# Altium schematic sheet Antenna.SchDoc
size A4
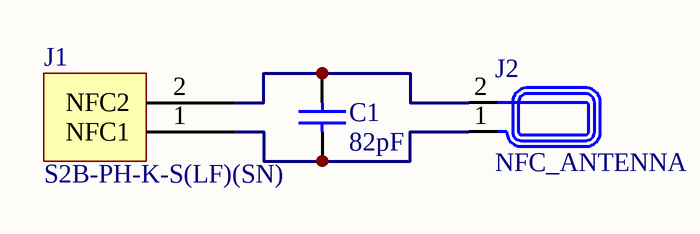
[diagram p0: Antenna.SchDoc]

## Parts
C1  value 82pF  [CAPC1608X08N]  (hidden comment: CL10C820JB8NNNC)
J1  S2B-PH-K-S(LF)(SN)  [S2B-PH-K-S]
J2  NFC_ANTENNA  [NFC_ANTENNA]

## Nets
NetC1_1: C1.1 J1.1(NFC1) J2.1(NFC1)
NetC1_2: C1.2 J1.2(NFC2) J2.2(NFC2)

## Library data of the parts
C1 = CL10C820JB8NNNC: Cap Ceramic 82pF 50V C0G 5% SMD 0603 125C Paper T/R; Manufacturer: Samsung; Temperature Coefficient: 300ppm/°C; Supplier 1: Digi-Key; Manufacturer Part Number: CL10C820JB8NNNC; Stock 1: 40000; Pricing 1: 1=0.1, 10=0.058, 100=0.0257, 500=0.0184, 1000=0.0144 (USD); Mount: Surface Mount; Case/Package: 0603; Case Code (Metric): 1608; Case Code (Imperial): 0603; Material: Ceramic; Contact Plating: Tin; Min Operating Temperature: -55°C; Max Operating Temperature: 125°C; Package Quantity: 1; Packaging: Tape and Reel; Capacitance: 82pF; Tolerance: 5%; Voltage Rating: 50V; Dielectric: C0G; Voltage: 50V; Voltage Rating (DC): 50V; Length: 1.6mm; Height: 0.8mm; Width: 0.031inch; Thickness: 0.035inch; Depth: 0.8mm; Radiation Hardening: No; Lead Free: Lead Free; Supplier Part Number 1: 1276-1242-1-ND
J1 = S2B-PH-K-S(LF)(SN): 2 Positions Header, Shrouded Connector 0.079" (2.00mm) Through Hole, Right Angle Tin; Manufacturer: JST; Contact Resistance: 20mR; Max Current Rating: 2A; Number of Positions: 2; Max Voltage Rating (AC): 100V; Insulation Resistance: 1GR; Gender: Male; Connector Type: Male Pin; Pitch: 2mm; Supplier 1: Digi-Key; Manufacturer Part Number: S2B-PH-K-S(LF)(SN); Stock 1: 238359; Pricing 1: 1=0.17, 10=0.161, 100=0.0991, 500=0.082, 1000=0.0718, 5000=0.0615, 10000=0.0598 (USD); Mount: Through Hole; Number of Pins: 2; Contact Material: Brass,Bronze,Tin; Contact Plating: Copper,Tin; Colour: Natural,White; Housing Colour: White; Housing Material: Polyamide; Min Operating Temperature: -25°C; Max Operating Temperature: 85°C; Number of Rows: 1; Current Rating: 2A; Packaging: Bulk; Termination: Solder; Fastening Type: Detent; Number of Contacts: 2; Working Voltage: 100V; Orientation: Right Angle; Voltage Rating: 100V; Number of Poles: 2; Voltage Rating (AC): 100V; Max Voltage Rating (DC): 100V; Length: 5.9mm; Height: 9.4mm; Width: 4.5mm; Depth: 7.6mm; Lead Pitch: 2mm; Contact Mating Length: 0.13inch; REACH SVHC: No SVHC; Lead Free: Lead Free; Flammability Rating: UL94 V-0; Supplier Part Number 1: 455-1719-ND